# EAGLE design board (EAGLE 9.5.1)
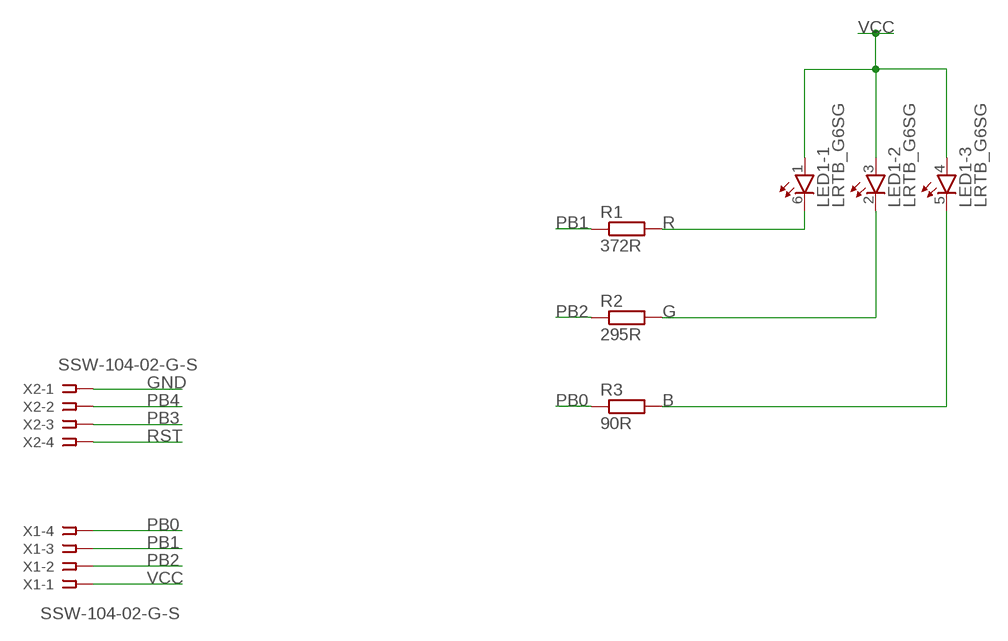
[diagram p0: schematic, sheet 1]

## Parts
LED1  LRTB_G6SG  [LRTB_G6SG]
R1  372R  R-EU_R1206  [R1206]
R2  295R  R-EU_R1206  [R1206]
R3  90R  R-EU_R1206  [R1206]
X1  SSW-104-02-G-S  [SSW-104-02-G-S]
X2  SSW-104-02-G-S  [SSW-104-02-G-S]

## Nets
B: LED1.5(-3:C) R3.2
G: LED1.2(-2:C) R2.2
GND: X2.1
PB0: R3.1 X1.4
PB1: R1.1 X1.3
PB2: R2.1 X1.2
PB3: X2.3
PB4: X2.2
R: LED1.6(-1:C) R1.2
RST: X2.4
VCC: LED1.1(-1:A) LED1.3(-2:A) LED1.4(-3:A) X1.1

## Library data of the parts
LED1 = led:LRTB_G6SG: LRTB G6SG 6-lead TOPLED® Source: OSRAM Opto Semiconductors ... LRTB_G6SG_Pb_free.pdf
R1-R3 = rcl:R-EU_: RESISTOR, European symbol; SPICEPREFIX: R
X1 X2 = con-samtec:SSW-104-02-G-S: THROUGH-HOLE .025" SQ POST SOCKET Source: Samtec SSW.pdf; MF: Samtec Inc.; MPN: SSW-104-02-G-S; OC_FARNELL: unknown; OC_NEWARK: 11P9384

## Board
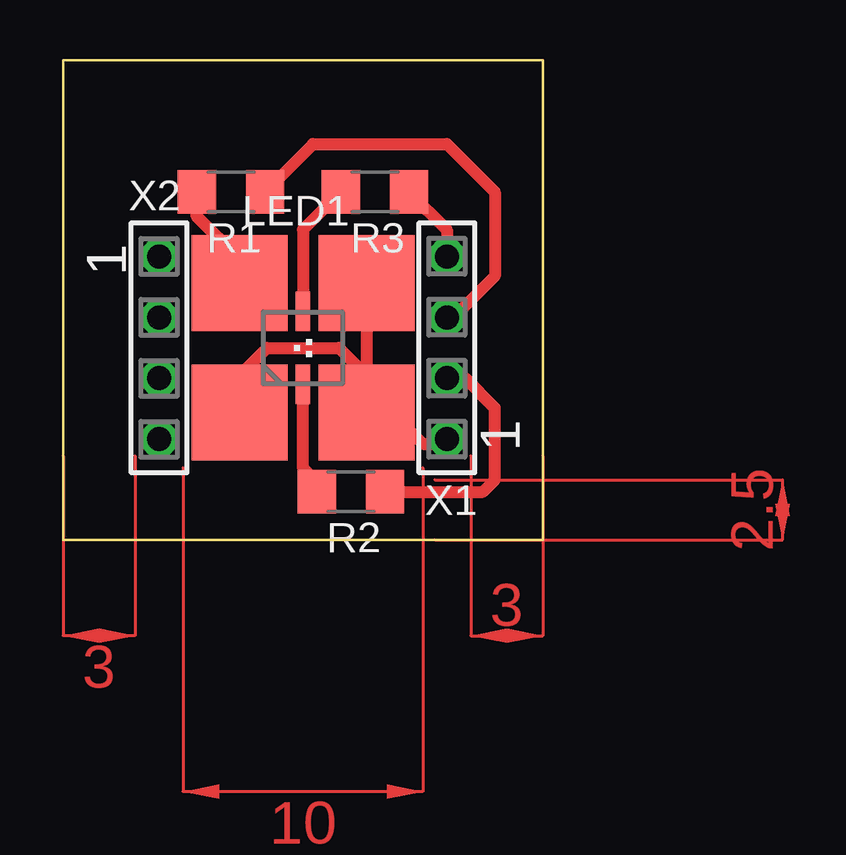
[diagram p1: board, top side]

Size 20 x 20 mm. Coordinates in mm from the lower left corner, seen from the top.
Outline: 0,20 20,20 20,0 0,0 0,20
Copper layers (1*16): Top 0.035mm / dielectric 1.5mm / Bottom 0.035mm
Design rules "default *": minimum track width 0.5mm, minimum drill 0.35mm, track to track 6mil, track to pad 6mil, pad to pad 6mil, via to via 6mil, smd to smd 6mil, copper to edge 40mil, drill to drill 6mil, minimum pad ring 10mil, minimum via ring 8mil, stop-mask expansion 4mil, vias tented up to drill 0mil, thermal gap 10mil

### Footprints (pad centres in the part's own frame; a part is rotated, then mirrored left to right if it is on the bottom)
LRTB_G6SG = smd 4 x 4: 1 -2.65,-2.7; 3 2.65,-2.7; 4 2.65,2.7; 6 -2.65,2.7 | smd 0.6 x 1.65: 2 0,-1.525; 5 0,1.525
R1206 = smd 1.6 x 1.803: 1 -1.422,0; 2 1.422,0
SSW-104-02-G-S = drill 1 pad 1.5 octagon: 1 -3.81,0; 2 -1.27,0; 3 1.27,0; 4 3.81,0

### Placement (x,y rotation side)
LED1  10,8 0 top
R1  7,14.5 180 top
R2  12,2 180 top
R3  13,14.5 180 top
X1  16,8 90 top
X2  4,8 270 top

### Tracks (layer width: path | path; a pad name or v marks a point on that pad's centre or on a via)
B
  Top 0.5: R3.2 10,12.92 LED1.5
G
  Top 0.5: LED1.2 10,3 10.58,2.42 R2.2
PB0
  Top 0.5: R3.1 16,12.92 X1.4
PB1
  Top 0.5: R1.1 10.42,16.5 16,16.5 18,14.5 18,11 16.27,9.27 X1.3
PB2
  Top 0.5: R2.1 17.5,2 18,2.5 18,5.5 16.77,6.73 X1.2
R
  Top 0.5: LED1.6 7.35,11.7 5.58,13.47 R1.2
VCC
  Top 0.5: LED1.4 12.65,6.85 | X1.1 15.81,4 15,4 13.7,5.3 LED1.3 12.65,6.5 12.65,6.85 | LED1.1 7.35,6.85 8.5,8 11.5,8 12.65,6.85
(copper drawn outside any net)
  shapes: Top area x4